# Altium project MDAP.PrjPcb
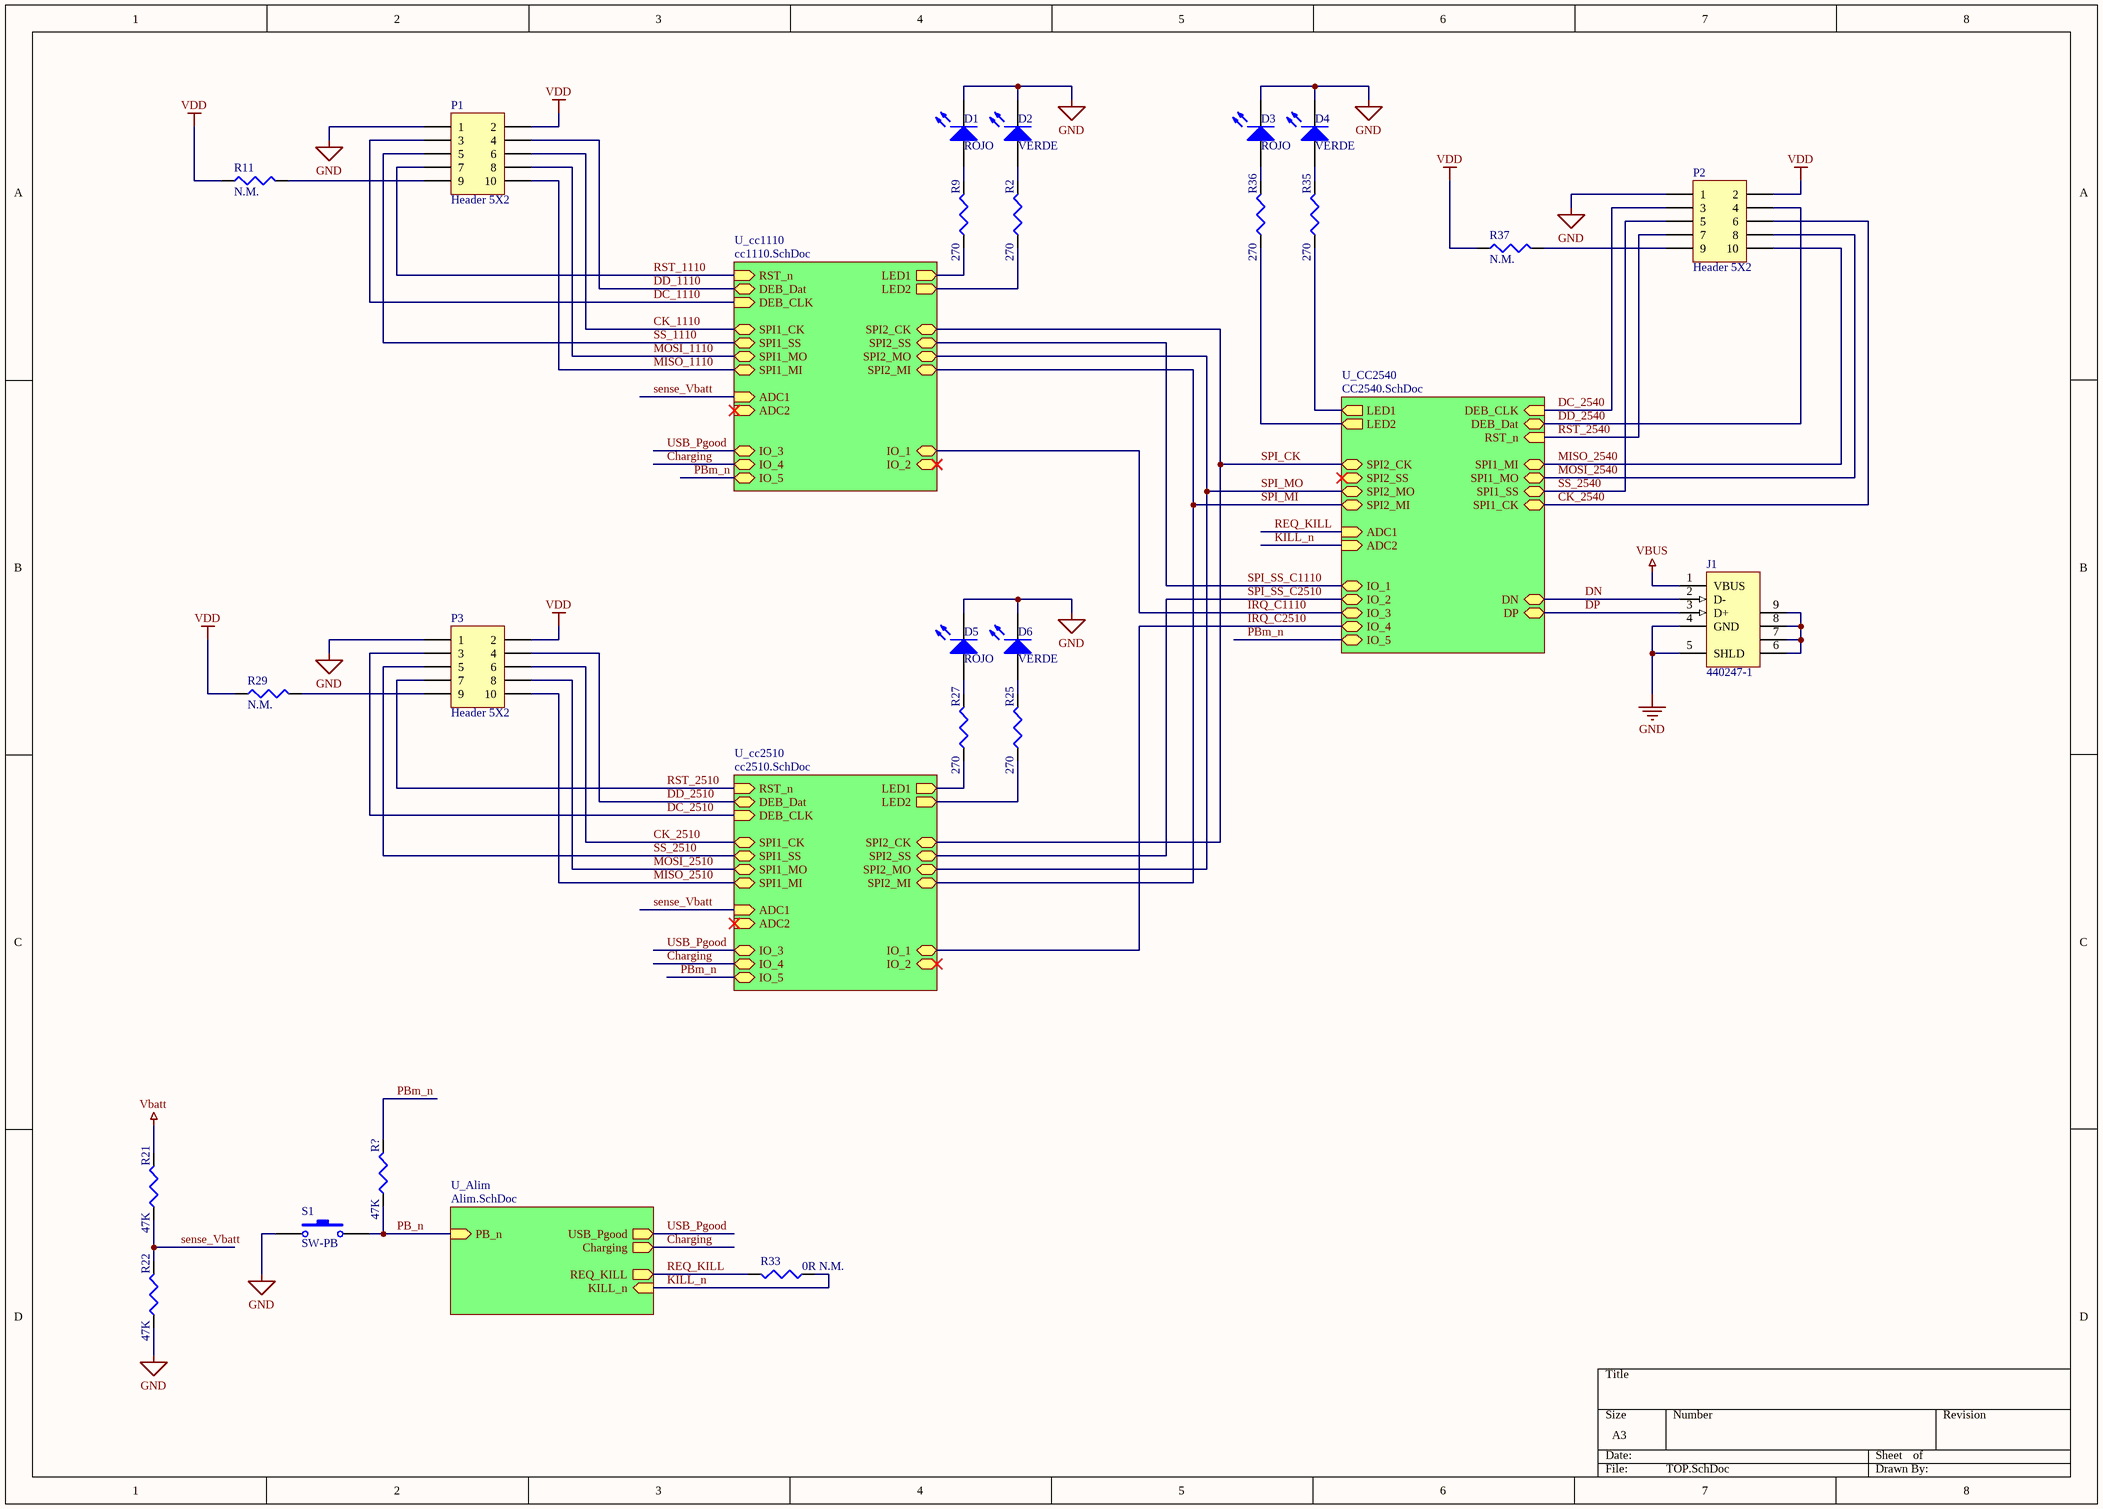
[diagram p0: TOP.SchDoc]
5 sheets, 153 parts. Net scope: hierarchical (ports join the sheet entries above them; power ports are global).
Board files: mdap.PcbDoc, mdap2.PcbDoc, mdap4.PcbDoc, mdap3.PcbDoc, mdap5.PcbDoc
Sheets:
  TOP.SchDoc
    U_cc1110 = cc1110.SchDoc
    U_cc2510 = cc2510.SchDoc
    U_CC2540 = CC2540.SchDoc
    U_Alim = Alim.SchDoc

## Sheet TOP.SchDoc
size A3

### Parts
D1  ROJO  [led_0805]
D2  VERDE  [led_0805]
D3  ROJO  [led_0805]
D4  VERDE  [led_0805]
D5  ROJO  [led_0805]
D6  VERDE  [led_0805]
J1  440247-1  [USB_C10418]
P1  Header 5X2  [stl21]
P2  Header 5X2  [stl21]
P3  Header 5X2  [stl21]
R2  value 270  [J1-0603]  (hidden comment: Res3)
R9  value 270  [J1-0603]  (hidden comment: Res3)
R11  value N.M.  [J1-0603]  (hidden comment: Res3)
R21  value 47K  [J1-0603]  (hidden comment: Res3)
R22  value 47K  [J1-0603]  (hidden comment: Res3)
R25  value 270  [J1-0603]  (hidden comment: Res3)
R27  value 270  [J1-0603]  (hidden comment: Res3)
R29  value N.M.  [J1-0603]  (hidden comment: Res3)
R33  value 0R N.M.  [J1-0603]  (hidden comment: Res3)
R35  value 270  [J1-0603]  (hidden comment: Res3)
R36  value 270  [J1-0603]  (hidden comment: Res3)
R37  value N.M.  [J1-0603]  (hidden comment: Res3)
R?  value 47K  [J1-0603]  (hidden comment: Res3)
S1  SW-PB  [puls_C3682]

### Sub-sheets
U_Alim = Alim.SchDoc: USB_Pgood (out), Charging (out), KILL_n (in), PB_n (in), REQ_KILL (out)
U_cc1110 = cc1110.SchDoc: DEB_Dat (bidir), DEB_CLK (in), RST_n (in), SPI1_MI (bidir), SPI1_MO (bidir), SPI1_SS (bidir), SPI1_CK (bidir), SPI2_CK (bidir), SPI2_SS (bidir), SPI2_MO (bidir), SPI2_MI (bidir), LED1 (out), LED2 (out), ADC1 (in), ADC2 (in), IO_1 (bidir), IO_2 (bidir), IO_3 (bidir), IO_4 (bidir), IO_5 (bidir)
U_cc2510 = cc2510.SchDoc: DEB_Dat (bidir), DEB_CLK (in), RST_n (in), SPI1_MI (bidir), SPI1_MO (bidir), SPI1_SS (bidir), SPI1_CK (bidir), SPI2_CK (bidir), SPI2_SS (bidir), SPI2_MO (bidir), SPI2_MI (bidir), LED1 (out), LED2 (out), ADC1 (in), ADC2 (in), IO_1 (bidir), IO_2 (bidir), IO_3 (bidir), IO_4 (bidir), IO_5 (bidir)
U_CC2540 = CC2540.SchDoc: DEB_Dat (bidir), DEB_CLK (in), RST_n (in), SPI1_MI (bidir), SPI1_MO (bidir), SPI1_SS (bidir), SPI1_CK (bidir), SPI2_CK (bidir), SPI2_SS (bidir), SPI2_MO (bidir), SPI2_MI (bidir), LED1 (out), LED2 (out), ADC1 (in), ADC2 (in), IO_1 (bidir), IO_2 (bidir), IO_3 (bidir), IO_4 (bidir), IO_5 (bidir), DP (bidir), DN (bidir)

### Nets
GND: D1.2(K) D2.2(K) D3.2(K) D4.2(K) D5.2(K) D6.2(K) J1.4(GND) J1.5(SHLD) P1.1 P2.1 P3.1 R22.1 S1.1
Vbatt: R21.2
VBUS: J1.1(VBUS)
VDD: P1.2 P2.2 P3.2 R11.1 R29.1 R37.1
Charging: sheet U_cc1110/IO_4, sheet U_cc2510/IO_4, sheet U_Alim/Charging
CK_1110: P1.6 ; sheet U_cc1110/SPI1_CK
CK_2510: P3.6 ; sheet U_cc2510/SPI1_CK
CK_2540: P2.6 ; sheet U_CC2540/SPI1_CK
DC_1110: P1.3 ; sheet U_cc1110/DEB_CLK
DC_2510: P3.3 ; sheet U_cc2510/DEB_CLK
DC_2540: P2.3 ; sheet U_CC2540/DEB_CLK
DD_1110: P1.4 ; sheet U_cc1110/DEB_Dat
DD_2510: P3.4 ; sheet U_cc2510/DEB_Dat
DD_2540: P2.4 ; sheet U_CC2540/DEB_Dat
DN: J1.2(D-) ; sheet U_CC2540/DN
DP: J1.3(D+) ; sheet U_CC2540/DP
IRQ_C1110: sheet U_cc1110/IO_1, sheet U_CC2540/IO_3
IRQ_C2510: sheet U_cc2510/IO_1, sheet U_CC2540/IO_4
KILL_n: R33.1 ; sheet U_CC2540/ADC2, sheet U_Alim/KILL_n
MISO_1110: P1.10 ; sheet U_cc1110/SPI1_MI
MISO_2510: P3.10 ; sheet U_cc2510/SPI1_MI
MISO_2540: P2.10 ; sheet U_CC2540/SPI1_MI
MOSI_1110: P1.8 ; sheet U_cc1110/SPI1_MO
MOSI_2510: P3.8 ; sheet U_cc2510/SPI1_MO
MOSI_2540: P2.8 ; sheet U_CC2540/SPI1_MO
PB_n: R?.1 S1.2 ; sheet U_Alim/PB_n
PBm_n: R?.2 ; sheet U_cc1110/IO_5, sheet U_cc2510/IO_5, sheet U_CC2540/IO_5
REQ_KILL: R33.2 ; sheet U_CC2540/ADC1, sheet U_Alim/REQ_KILL
RST_1110: P1.7 ; sheet U_cc1110/RST_n
RST_2510: P3.7 ; sheet U_cc2510/RST_n
RST_2540: P2.7 ; sheet U_CC2540/RST_n
sense_Vbatt: R21.1 R22.2 ; sheet U_cc1110/ADC1, sheet U_cc2510/ADC1
SPI_CK: sheet U_cc1110/SPI2_CK, sheet U_cc2510/SPI2_CK, sheet U_CC2540/SPI2_CK
SPI_MI: sheet U_cc1110/SPI2_MI, sheet U_cc2510/SPI2_MI, sheet U_CC2540/SPI2_MI
SPI_MO: sheet U_cc1110/SPI2_MO, sheet U_cc2510/SPI2_MO, sheet U_CC2540/SPI2_MO
SPI_SS_C1110: sheet U_cc1110/SPI2_SS, sheet U_CC2540/IO_1
SPI_SS_C2510: sheet U_cc2510/SPI2_SS, sheet U_CC2540/IO_2
SS_1110: P1.5 ; sheet U_cc1110/SPI1_SS
SS_2510: P3.5 ; sheet U_cc2510/SPI1_SS
SS_2540: P2.5 ; sheet U_CC2540/SPI1_SS
USB_Pgood: sheet U_cc1110/IO_3, sheet U_cc2510/IO_3, sheet U_Alim/USB_Pgood
NetD1_1: D1.1(A) R9.2
NetD2_1: D2.1(A) R2.2
NetD3_1: D3.1(A) R36.2
NetD4_1: D4.1(A) R35.2
NetD5_1: D5.1(A) R27.2
NetD6_1: D6.1(A) R25.2
NetJ1_6: J1.6(SHLD) J1.7(SHLD) J1.8(SHLD) J1.9(SHLD)
NetP1_9: P1.9 R11.2
NetP2_9: P2.9 R37.2
NetP3_9: P3.9 R29.2
NetR2_1: R2.1 ; sheet U_cc1110/LED2
NetR9_1: R9.1 ; sheet U_cc1110/LED1
NetR25_1: R25.1 ; sheet U_cc2510/LED2
NetR27_1: R27.1 ; sheet U_cc2510/LED1
NetR35_1: R35.1 ; sheet U_CC2540/LED1
NetR36_1: R36.1 ; sheet U_CC2540/LED2

### Library data of the parts
D1 D3 D5 = LED2: Typical RED, GREEN, YELLOW, AMBER GaAs LED; Manufacturer: Smart Prototyping; SP: SP-C2286; FARNELL: 2099236; Value: Rojo; Order N: SP-C2286
D2 D4 D6 = LED2: Typical RED, GREEN, YELLOW, AMBER GaAs LED; Manufacturer: Smart Prototyping; SP: SP-C2292; FARNELL: 2290331; Value: Verde; Order N: SP-C2292
J1 = 440247-1: USB 2.0, Right Angle, SMT, B Type, Receptacle, 5 Position, Black; Manufacturer: Smart Prototyping; SP: SP-C10418; Published: 15-Jul-2004; PackageReference: 440247; Publisher: Altium Limited; Order N: SP-C10418
P1-P3 = Header 5X2: Header, 5-Pin, Dual row; Manufacturer: Smart Prototyping; SP: SP-C12650; LatestRevisionDate: 17-Jul-2002; LatestRevisionNote: Re-released for DXP Platform.; Publisher: Altium Limited; Order N: SP-C12650
R2 R9 R25 R27 R35 R36 = Res3: Resistor; Manufacturer: FARNELL; RS: 721-7292; Order N: 2331719; Published: 8-Jun-2000; LatestRevisionDate: 29-May-2009; LatestRevisionNote: IPC-7351 Footprint Added.; PackageReference: J1-0603; Publisher: Altium Limited; PackageDescription: Chip Resistor; FARNELL: 2331719
R11 R29 R37 = Res3: Resistor; Published: 8-Jun-2000; LatestRevisionDate: 29-May-2009; LatestRevisionNote: IPC-7351 Footprint Added.; PackageReference: J1-0603; Publisher: Altium Limited; PackageDescription: Chip Resistor
R21 R22 R? = Res3: Resistor; Manufacturer: FARNELL; RS: N.E.; Order N: 2331749; Published: 8-Jun-2000; LatestRevisionDate: 29-May-2009; LatestRevisionNote: IPC-7351 Footprint Added.; PackageReference: J1-0603; Publisher: Altium Limited; PackageDescription: Chip Resistor; FARNELL: 2331749
R33 = Res3: Resistor; RS: 740-8870; Published: 8-Jun-2000; LatestRevisionDate: 29-May-2009; LatestRevisionNote: IPC-7351 Footprint Added.; PackageReference: J1-0603; Publisher: Altium Limited; PackageDescription: Chip Resistor; FARNELL: 2309106
S1 = SW-PB: Switch; Manufacturer: Smart Prototyping; SP: SP-C3682; Published: 24-Mar-1999; LatestRevisionDate: 17-Jul-2002; LatestRevisionNote: Re-released for DXP Platform.; PackageReference: SPST-2; Publisher: Altium Limited; PackageDescription: Switch; 2 Leads; Order N: SP-C3682

## Sheet cc1110.SchDoc
size A3
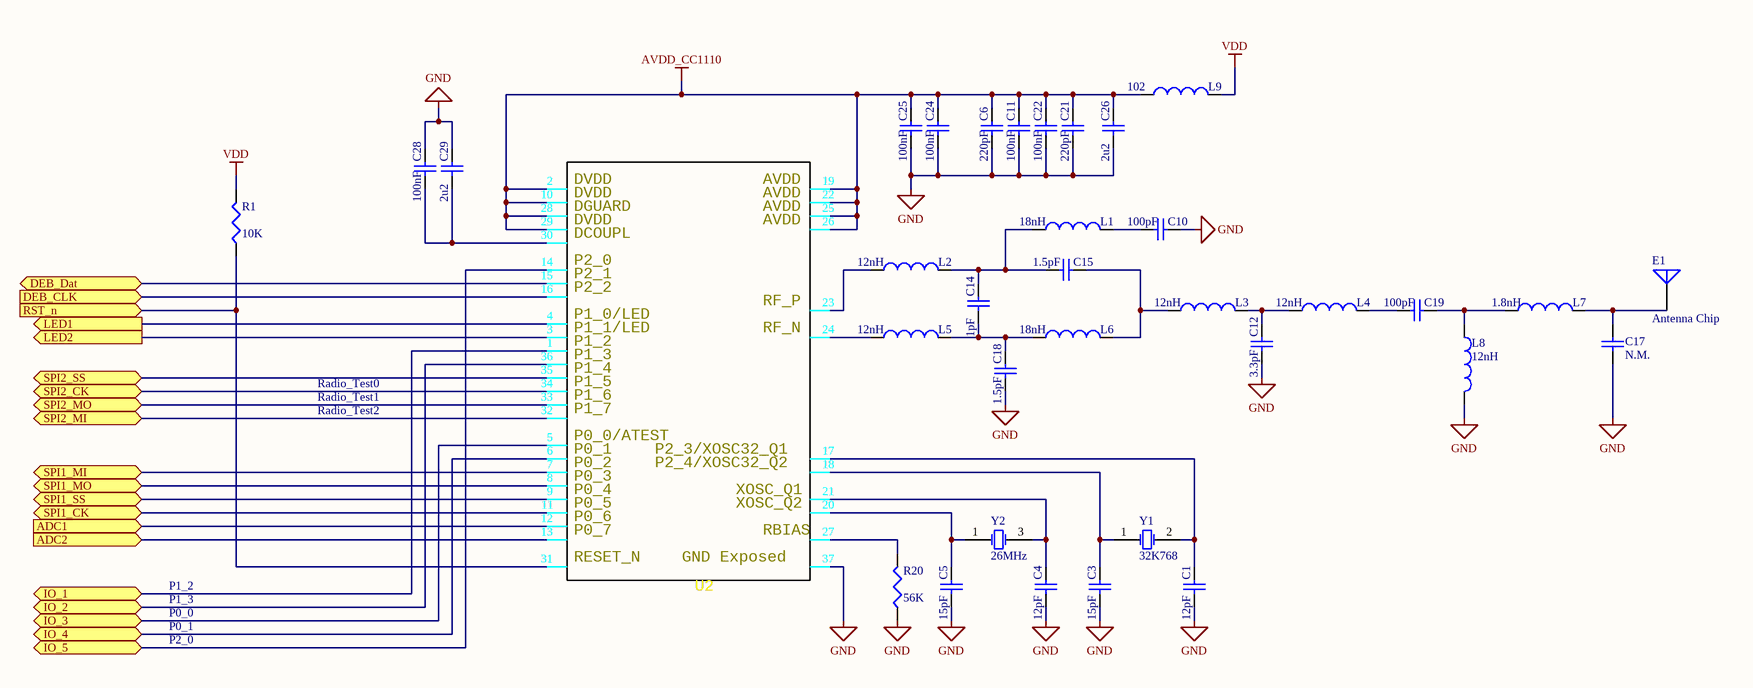
[diagram p1: cc1110.SchDoc]

### Parts
C1  value 12pF  [0402]  (hidden comment: Cap)
C3  value 15pF  [0402]  (hidden comment: Cap)
C4  value 12pF  [0402]  (hidden comment: Cap)
C5  value 15pF  [0402]  (hidden comment: Cap)
C6  value 220pF  [0402]  (hidden comment: Cap)
C10  value 100pF  [0402]  (hidden comment: Cap)
C11  value 100nF  [0402]  (hidden comment: Cap)
C12  value 3.3pF  [0402]  (hidden comment: Cap)
C14  value 1pF  [0402]  (hidden comment: Cap)
C15  value 1.5pF  [0402]  (hidden comment: Cap)
C17  value N.M.  [0402]  (hidden comment: Cap)
C18  value 1.5pF  [0402]  (hidden comment: Cap)
C19  value 100pF  [0402]  (hidden comment: Cap)
C21  value 220pF  [0402]  (hidden comment: Cap)
C22  value 100nF  [0402]  (hidden comment: Cap)
C24  value 100nF  [0402]  (hidden comment: Cap)
C25  value 100nF  [0402]  (hidden comment: Cap)
C26  value 2u2  [C0805]  (hidden comment: Cap)
C28  value 100nF  [0402]  (hidden comment: Cap)
C29  value 2u2  [C0805]  (hidden comment: Cap)
E1  Antenna Chip  [Johanson_0868AT43A0020]
L1  value 18nH  [0402-A]  (hidden comment: Inductor)
L2  value 12nH  [0402-A]  (hidden comment: Inductor)
L3  value 12nH  [0402-A]  (hidden comment: Inductor)
L4  value 12nH  [0402-A]  (hidden comment: Inductor)
L5  value 12nH  [0402-A]  (hidden comment: Inductor)
L6  value 18nH  [0402-A]  (hidden comment: Inductor)
L7  value 1.8nH  [0402-A]  (hidden comment: Inductor)
L8  value 12nH  [0402-A]  (hidden comment: Inductor)
L9  value 102  [0402-A]  (hidden comment: Inductor)
R1  value 10K  [J1-0603]  (hidden comment: Res3)
R20  value 56K  [J1-0603]  (hidden comment: Res3)
U2  CC1110  [QLP36_4_4 (Reflow)]  (value not drawn)
Y1  32K768  [xtal_3215]
Y2  26MHz  [xtal_3225]

### Ports
ADC1 (in), ADC2 (in), DEB_CLK (in), DEB_Dat (bidir), IO_1 (bidir), IO_2 (bidir), IO_3 (bidir), IO_4 (bidir), IO_5 (bidir), LED1 (out), LED2 (out), RST_n (in), SPI1_CK (bidir), SPI1_MI (bidir), SPI1_MO (bidir), SPI1_SS (bidir), SPI2_CK (bidir), SPI2_MI (bidir), SPI2_MO (bidir), SPI2_SS (bidir)

### Nets
AVDD_CC1110: C6.2 C11.2 C21.2 C22.2 C24.2 C25.2 C26.2 L9.1 U2.2 U2.10 U2.19 U2.22 U2.25 U2.26 U2.28 U2.29
GND: C1.1 C3.1 C4.1 C5.1 C6.1 C10.1 C11.1 C12.1 C17.2 C18.1 C21.1 C22.1 C24.1 C25.1 C26.1 C28.2 C29.2 L8.2 R20.1 U2.37
VDD: L9.2 R1.2
Charging: U2.6 ; port IO_4
CK_1110: U2.11 ; port SPI1_CK
DC_1110: U2.16 ; port DEB_CLK
DD_1110: U2.15 ; port DEB_Dat
IRQ_C1110: U2.1 ; port IO_1
MISO_1110: U2.7 ; port SPI1_MI
MOSI_1110: U2.8 ; port SPI1_MO
PBm_n: U2.14 ; port IO_5
RST_1110: R1.1 U2.31 ; port RST_n
sense_Vbatt: U2.12 ; port ADC1
SPI_CK: U2.34 ; port SPI2_CK
SPI_MI: U2.32 ; port SPI2_MI
SPI_MO: U2.33 ; port SPI2_MO
SPI_SS_C1110: U2.35 ; port SPI2_SS
SS_1110: U2.9 ; port SPI1_SS
USB_Pgood: U2.5 ; port IO_3
NetC1_2: C1.2 U2.17 Y1.2(OSC2)
NetC3_2: C3.2 U2.18 Y1.1(OSC1)
NetC4_2: C4.2 U2.21 Y2.3(OSC2)
NetC5_2: C5.2 U2.20 Y2.1(OSC1)
NetC10_2: C10.2 L1.2
NetC12_2: C12.2 L3.2 L4.1
NetC14_1: C14.1 C18.2 L5.2 L6.1
NetC14_2: C14.2 C15.2 L1.1 L2.2
NetC15_1: C15.1 L3.1 L6.2
NetC17_1: C17.1 E1.1(A) L7.2
NetC19_1: C19.1 L7.1 L8.1
NetC19_2: C19.2 L4.2
NetC28_1: C28.1 C29.1 U2.30
NetL2_1: L2.1 U2.23
NetL5_1: L5.1 U2.24
NetR2_1: U2.3 ; port LED2
NetR9_1: U2.4 ; port LED1
NetR20_2: R20.2 U2.27
NetU2_13: U2.13 ; port ADC2
NetU2_36: U2.36 ; port IO_2

### Notes on the sheet
- Radio_Test0
- Radio_Test1
- Radio_Test2
- P1_2
- P1_3
- P0_0
- P0_1
- P2_0
- (in symbol CC1110) DVDD; AVDD; DGUARD; DCOUPL; P2_0; P2_1; P2_2; RF_P; P1_0/LED; P1_1/LED; RF_N; P1_2; P1_3; P1_4; P1_5; P1_6; P1_7; P0_0/ATEST; P0_1; P2_3/XOSC32_Q1; P0_2; P2_4/XOSC32_Q2; P0_3; P0_4; XOSC_Q1; P0_5; XOSC_Q2; P0_6; P0_7; RBIAS; RESET_N; GND Exposed

### Library data of the parts
C1 C4 = Cap: Capacitor; Manufacturer: FARNELL; RS: 788-0263; Order N: 2210762; Published: 8-Jun-2000; LatestRevisionDate: 17-Jul-2002; LatestRevisionNote: Re-released for DXP Platform.; PackageReference: RAD-0.3; Publisher: Altium Limited; PackageDescription: Radial Cap, Thru-Hole; 2 Leads; 0.3 in Pin Spacing; FARNELL: 2210762
C3 C5 = Cap: Capacitor; Manufacturer: FARNELL; RS: 788-0266; Order N: 2218840; Published: 8-Jun-2000; LatestRevisionDate: 17-Jul-2002; LatestRevisionNote: Re-released for DXP Platform.; PackageReference: RAD-0.3; Publisher: Altium Limited; PackageDescription: Radial Cap, Thru-Hole; 2 Leads; 0.3 in Pin Spacing; FARNELL: 2218840
C6 C21 = Cap: Capacitor; Manufacturer: FARNELL; RS: 624-2941; Order N: 2426879; Published: 8-Jun-2000; LatestRevisionDate: 17-Jul-2002; LatestRevisionNote: Re-released for DXP Platform.; PackageReference: RAD-0.3; Publisher: Altium Limited; PackageDescription: Radial Cap, Thru-Hole; 2 Leads; 0.3 in Pin Spacing; FARNELL: 2426879
C10 C19 = Cap: Capacitor; Manufacturer: FARNELL; RS: 806-8495; Order N: 2426878; Published: 8-Jun-2000; LatestRevisionDate: 17-Jul-2002; LatestRevisionNote: Re-released for DXP Platform.; PackageReference: RAD-0.3; Publisher: Altium Limited; PackageDescription: Radial Cap, Thru-Hole; 2 Leads; 0.3 in Pin Spacing; FARNELL: 2426878
C11 C22 C24 C25 C28 = Cap: Capacitor; Manufacturer: FARNELL; RS: 788-2843; Order N: 2309011; Published: 8-Jun-2000; LatestRevisionDate: 17-Jul-2002; LatestRevisionNote: Re-released for DXP Platform.; PackageReference: RAD-0.3; Publisher: Altium Limited; PackageDescription: Radial Cap, Thru-Hole; 2 Leads; 0.3 in Pin Spacing; FARNELL: 2309011
C12 = Cap: Capacitor; Manufacturer: FARNELL; RS: 751-2049; Order N: 2210780; Published: 8-Jun-2000; LatestRevisionDate: 17-Jul-2002; LatestRevisionNote: Re-released for DXP Platform.; PackageReference: RAD-0.3; Publisher: Altium Limited; PackageDescription: Radial Cap, Thru-Hole; 2 Leads; 0.3 in Pin Spacing; FARNELL: 2210780
C14 = Cap: Capacitor; Manufacturer: FARNELL; RS: 788-0279; Order N: 1611944; Published: 8-Jun-2000; LatestRevisionDate: 17-Jul-2002; LatestRevisionNote: Re-released for DXP Platform.; PackageReference: RAD-0.3; Publisher: Altium Limited; PackageDescription: Radial Cap, Thru-Hole; 2 Leads; 0.3 in Pin Spacing; FARNELL: 1611944
C15 C18 = Cap: Capacitor; Manufacturer: FARNELL; RS: 788-0276; Order N: 1828869; Published: 8-Jun-2000; LatestRevisionDate: 17-Jul-2002; LatestRevisionNote: Re-released for DXP Platform.; PackageReference: RAD-0.3; Publisher: Altium Limited; PackageDescription: Radial Cap, Thru-Hole; 2 Leads; 0.3 in Pin Spacing; FARNELL: 1828869
C17 = Cap: Capacitor; Published: 8-Jun-2000; LatestRevisionDate: 17-Jul-2002; LatestRevisionNote: Re-released for DXP Platform.; PackageReference: RAD-0.3; Publisher: Altium Limited; PackageDescription: Radial Cap, Thru-Hole; 2 Leads; 0.3 in Pin Spacing
C26 C29 = Cap: Capacitor; Manufacturer: FARNELL; RS: 749-2138; Order N: 1759416; Published: 8-Jun-2000; LatestRevisionDate: 17-Jul-2002; LatestRevisionNote: Re-released for DXP Platform.; PackageReference: RAD-0.3; Publisher: Altium Limited; PackageDescription: Radial Cap, Thru-Hole; 2 Leads; 0.3 in Pin Spacing; FARNELL: 1759416
E1 = Antenna: Generic Antenna; Manufacturer: FARNELL; RS: N.E.; PN: 0868AT43A0020E; Order N: 1885493; Published: 24-Mar-1999; LatestRevisionDate: 17-Jul-2002; LatestRevisionNote: Re-released for DXP Platform.; PackageReference: PIN1; Publisher: Altium Limited; FARNELL: 1885493
L1 L6 = Inductor: Manufacturer: FARNELL; Code_IEC: 1005; RS: 777-7022; Order N: 2103101; Published: 8-Jun-2000; LatestRevisionDate: 29-May-2009; LatestRevisionNote: IPC-7351 Footprint Added.; PackageReference: 0402-A; Publisher: Altium Limited; PackageDescription: Chip Inductor; Code_JEITA: 0402; FARNELL: 2103101
L2-L5 L8 = Inductor: Manufacturer: FARNELL; Code_IEC: 1005; RS: 701-6910; Order N: 2103098; Published: 8-Jun-2000; LatestRevisionDate: 29-May-2009; LatestRevisionNote: IPC-7351 Footprint Added.; PackageReference: 0402-A; Publisher: Altium Limited; PackageDescription: Chip Inductor; Code_JEITA: 0402; FARNELL: 2103098
L7 = Inductor: Manufacturer: FARNELL; Code_IEC: 1005; RS: 701-6807; Order N: 1669627; Published: 8-Jun-2000; LatestRevisionDate: 29-May-2009; LatestRevisionNote: IPC-7351 Footprint Added.; PackageReference: 0402-A; Publisher: Altium Limited; PackageDescription: Chip Inductor; Code_JEITA: 0402; FARNELL: 1669627
L9 = Inductor: Manufacturer: FARNELL; Code_IEC: 1005; RS: 777-6861; Order N: 1669624; Published: 8-Jun-2000; LatestRevisionDate: 29-May-2009; LatestRevisionNote: IPC-7351 Footprint Added.; PackageReference: 0402-A; Publisher: Altium Limited; PackageDescription: Chip Inductor; Code_JEITA: 0402; FARNELL: 1669624
R1 = Res3: Resistor; Manufacturer: FARNELL; RS: N.E.; Order N: 2333520; Published: 8-Jun-2000; LatestRevisionDate: 29-May-2009; LatestRevisionNote: IPC-7351 Footprint Added.; PackageReference: J1-0603; Publisher: Altium Limited; PackageDescription: Chip Resistor; FARNELL: 2333520
R20 = Res3: Resistor; Manufacturer: FARNELL; RS: N.E.; Order N: 2331750; Published: 8-Jun-2000; LatestRevisionDate: 29-May-2009; LatestRevisionNote: IPC-7351 Footprint Added.; PackageReference: J1-0603; Publisher: Altium Limited; PackageDescription: Chip Resistor; FARNELL: 2331750
U2 = CC1110: Single chip transceiver; Manufacturer: FARNELL; RS: 459-342; PN: CC1110F32RHHR; Order N: 2422916; FARNELL: 2422916
Y1 = XTAL: Crystal Oscillator; Manufacturer: Smart Prototyping; SP: SP-C14473; Value: 32.768KHz; FARNELL: 2449398; Order N: SP-C14473
Y2 = XTAL_4: Crystal Oscillator; Manufacturer: Smart Prototyping; SP: SP-C23363; RS: *; FARNELL: 2101340; Value: 26MHz; Order N: SP-C23363

## Sheet cc2510.SchDoc
size A3
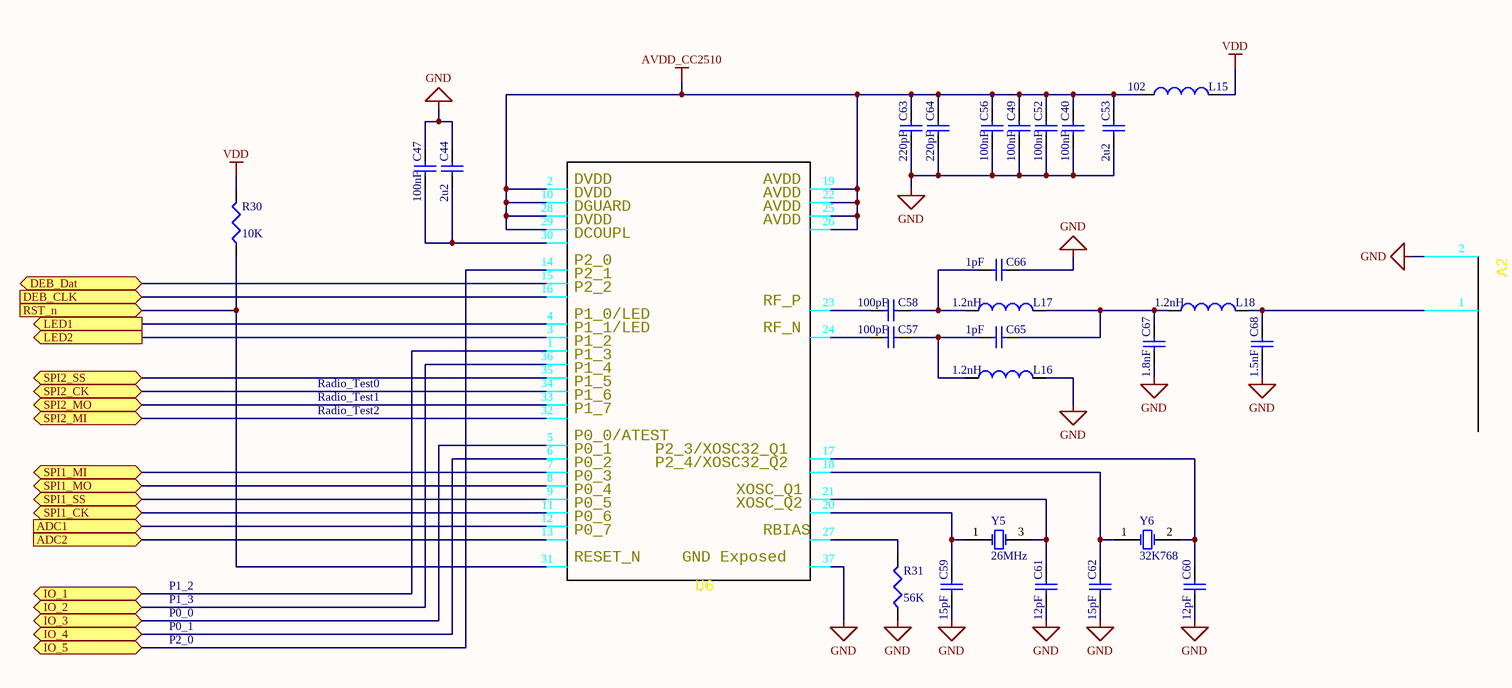
[diagram p2: cc2510.SchDoc]

### Parts
A2  Antenna_IIFA_1  [antenna_IIFA_1]  (value not drawn)
C40  value 100nF  [0402]  (hidden comment: Cap)
C44  value 2u2  [C0805]  (hidden comment: Cap)
C47  value 100nF  [0402]  (hidden comment: Cap)
C49  value 100nF  [0402]  (hidden comment: Cap)
C52  value 100nF  [0402]  (hidden comment: Cap)
C53  value 2u2  [C0805]  (hidden comment: Cap)
C56  value 100nF  [0402]  (hidden comment: Cap)
C57  value 100pF  [0402]  (hidden comment: Cap)
C58  value 100pF  [0402]  (hidden comment: Cap)
C59  value 15pF  [0402]  (hidden comment: Cap)
C60  value 12pF  [0402]  (hidden comment: Cap)
C61  value 12pF  [0402]  (hidden comment: Cap)
C62  value 15pF  [0402]  (hidden comment: Cap)
C63  value 220pF  [0402]  (hidden comment: Cap)
C64  value 220pF  [0402]  (hidden comment: Cap)
C65  value 1pF  [0402]  (hidden comment: Cap)
C66  value 1pF  [0402]  (hidden comment: Cap)
C67  value 1.8nF  [0402]  (hidden comment: Cap)
C68  value 1.5nF  [0402]  (hidden comment: Cap)
L15  value 102  [0402-A]  (hidden comment: Inductor)
L16  value 1.2nH  [0402-A]  (hidden comment: Inductor)
L17  value 1.2nH  [0402-A]  (hidden comment: Inductor)
L18  value 1.2nH  [0402-A]  (hidden comment: Inductor)
R30  value 10K  [J1-0603]  (hidden comment: Res3)
R31  value 56K  [J1-0603]  (hidden comment: Res3)
U6  CC2510  [QLP36_4_4 norteam silk (Reflow)]  (value not drawn)
Y5  26MHz  [xtal_3225]
Y6  32K768  [xtal_3215]

### Ports
ADC1 (in), ADC2 (in), DEB_CLK (in), DEB_Dat (bidir), IO_1 (bidir), IO_2 (bidir), IO_3 (bidir), IO_4 (bidir), IO_5 (bidir), LED1 (out), LED2 (out), RST_n (in), SPI1_CK (bidir), SPI1_MI (bidir), SPI1_MO (bidir), SPI1_SS (bidir), SPI2_CK (bidir), SPI2_MI (bidir), SPI2_MO (bidir), SPI2_SS (bidir)

### Nets
AVDD_CC2510: C40.2 C49.2 C52.2 C53.2 C56.2 C63.2 C64.2 L15.1 U6.2 U6.10 U6.19 U6.22 U6.25 U6.26 U6.28 U6.29
GND: A2.2 C40.1 C44.2 C47.2 C49.1 C52.1 C53.1 C56.1 C59.1 C60.1 C61.1 C62.1 C63.1 C64.1 C66.1 C67.1 C68.1 L16.2 R31.1 U6.37
VDD: L15.2 R30.2
Charging: U6.6 ; port IO_4
CK_2510: U6.11 ; port SPI1_CK
DC_2510: U6.16 ; port DEB_CLK
DD_2510: U6.15 ; port DEB_Dat
IRQ_C2510: U6.1 ; port IO_1
MISO_2510: U6.7 ; port SPI1_MI
MOSI_2510: U6.8 ; port SPI1_MO
PBm_n: U6.14 ; port IO_5
RST_2510: R30.1 U6.31 ; port RST_n
sense_Vbatt: U6.12 ; port ADC1
SPI_CK: U6.34 ; port SPI2_CK
SPI_MI: U6.32 ; port SPI2_MI
SPI_MO: U6.33 ; port SPI2_MO
SPI_SS_C2510: U6.35 ; port SPI2_SS
SS_2510: U6.9 ; port SPI1_SS
USB_Pgood: U6.5 ; port IO_3
NetA2_1: A2.1 C68.2 L18.2
NetC44_1: C44.1 C47.1 U6.30
NetC57_1: C57.1 C65.2 L16.1
NetC57_2: C57.2 U6.24
NetC58_1: C58.1 C66.2 L17.1
NetC58_2: C58.2 U6.23
NetC59_2: C59.2 U6.20 Y5.1(OSC1)
NetC60_2: C60.2 U6.17 Y6.2(OSC2)
NetC61_2: C61.2 U6.21 Y5.3(OSC2)
NetC62_2: C62.2 U6.18 Y6.1(OSC1)
NetC65_1: C65.1 C67.2 L17.2 L18.1
NetR25_1: U6.3 ; port LED2
NetR27_1: U6.4 ; port LED1
NetR31_2: R31.2 U6.27
NetU6_13: U6.13 ; port ADC2
NetU6_36: U6.36 ; port IO_2

### Notes on the sheet
- Radio_Test0
- Radio_Test1
- Radio_Test2
- P1_2
- P1_3
- P0_0
- P0_1
- P2_0
- (in symbol CC2510) DVDD; AVDD; DGUARD; DCOUPL; P2_0; P2_1; P2_2; RF_P; P1_0/LED; P1_1/LED; RF_N; P1_2; P1_3; P1_4; P1_5; P1_6; P1_7; P0_0/ATEST; P0_1; P2_3/XOSC32_Q1; P0_2; P2_4/XOSC32_Q2; P0_3; P0_4; XOSC_Q1; P0_5; XOSC_Q2; P0_6; P0_7; RBIAS; RESET_N; GND Exposed

### Library data of the parts
A2 = Antenna_IIFA_1: Antenna single ended IIFA, 2450 MHz
C40 C47 C49 C52 C56 = Cap: as C11 on sheet cc1110; Published: 8-Jun-2000; LatestRevisionDate: 17-Jul-2002; LatestRevisionNote: Re-released for DXP Platform.; PackageReference: RAD-0.3; Publisher: Altium Limited; PackageDescription: Radial Cap, Thru-Hole; 2 Leads; 0.3 in Pin Spacing; FARNELL: 2309011
C44 C53 = Cap: as C26 on sheet cc1110; Published: 8-Jun-2000; LatestRevisionDate: 17-Jul-2002; LatestRevisionNote: Re-released for DXP Platform.; PackageReference: RAD-0.3; Publisher: Altium Limited; PackageDescription: Radial Cap, Thru-Hole; 2 Leads; 0.3 in Pin Spacing; FARNELL: 1759416
C57 C58 = Cap: as C10 on sheet cc1110; Published: 8-Jun-2000; LatestRevisionDate: 17-Jul-2002; LatestRevisionNote: Re-released for DXP Platform.; PackageReference: RAD-0.3; Publisher: Altium Limited; PackageDescription: Radial Cap, Thru-Hole; 2 Leads; 0.3 in Pin Spacing; FARNELL: 2426878
C59 C62 = Cap: as C3 on sheet cc1110; Published: 8-Jun-2000; LatestRevisionDate: 17-Jul-2002; LatestRevisionNote: Re-released for DXP Platform.; PackageReference: RAD-0.3; Publisher: Altium Limited; PackageDescription: Radial Cap, Thru-Hole; 2 Leads; 0.3 in Pin Spacing; FARNELL: 2218840
C60 C61 = Cap: as C1 on sheet cc1110; Published: 8-Jun-2000; LatestRevisionDate: 17-Jul-2002; LatestRevisionNote: Re-released for DXP Platform.; PackageReference: RAD-0.3; Publisher: Altium Limited; PackageDescription: Radial Cap, Thru-Hole; 2 Leads; 0.3 in Pin Spacing; FARNELL: 2210762
C63 C64 = Cap: as C6 on sheet cc1110; Published: 8-Jun-2000; LatestRevisionDate: 17-Jul-2002; LatestRevisionNote: Re-released for DXP Platform.; PackageReference: RAD-0.3; Publisher: Altium Limited; PackageDescription: Radial Cap, Thru-Hole; 2 Leads; 0.3 in Pin Spacing; FARNELL: 2426879
C65 C66 = Cap: as C14 on sheet cc1110; Published: 8-Jun-2000; LatestRevisionDate: 17-Jul-2002; LatestRevisionNote: Re-released for DXP Platform.; PackageReference: RAD-0.3; Publisher: Altium Limited; PackageDescription: Radial Cap, Thru-Hole; 2 Leads; 0.3 in Pin Spacing; FARNELL: 1611944
C67 = Cap: Capacitor; Manufacturer: FARNELL; RS: 755-2033; Order N: 1865457; Published: 8-Jun-2000; LatestRevisionDate: 17-Jul-2002; LatestRevisionNote: Re-released for DXP Platform.; PackageReference: RAD-0.3; Publisher: Altium Limited; PackageDescription: Radial Cap, Thru-Hole; 2 Leads; 0.3 in Pin Spacing; FARNELL: 1865457
C68 = Cap: Capacitor; Manufacturer: FARNELL; RS: 806-8489; Order N: 2210797; Published: 8-Jun-2000; LatestRevisionDate: 17-Jul-2002; LatestRevisionNote: Re-released for DXP Platform.; PackageReference: RAD-0.3; Publisher: Altium Limited; PackageDescription: Radial Cap, Thru-Hole; 2 Leads; 0.3 in Pin Spacing; FARNELL: 2210797
L15 = Inductor: as L9 on sheet cc1110; Published: 8-Jun-2000; LatestRevisionDate: 29-May-2009; LatestRevisionNote: IPC-7351 Footprint Added.; PackageReference: 0402-A; Publisher: Altium Limited; PackageDescription: Chip Inductor; Code_JEITA: 0402; FARNELL: 1669624
L16-L18 = Inductor: Manufacturer: FARNELL; Code_IEC: 1005; RS: 701-6784; Order N: 1704133; Published: 8-Jun-2000; LatestRevisionDate: 29-May-2009; LatestRevisionNote: IPC-7351 Footprint Added.; PackageReference: 0402-A; Publisher: Altium Limited; PackageDescription: Chip Inductor; Code_JEITA: 0402; FARNELL: 1704133
R30 = Res3: as R1 on sheet cc1110; Published: 8-Jun-2000; LatestRevisionDate: 29-May-2009; LatestRevisionNote: IPC-7351 Footprint Added.; PackageReference: J1-0603; Publisher: Altium Limited; PackageDescription: Chip Resistor; FARNELL: 2333520
R31 = Res3: as R20 on sheet cc1110; Published: 8-Jun-2000; LatestRevisionDate: 29-May-2009; LatestRevisionNote: IPC-7351 Footprint Added.; PackageReference: J1-0603; Publisher: Altium Limited; PackageDescription: Chip Resistor; FARNELL: 2331750
U6 = CC2510: Single chip transceiver; Manufacturer: FARNELL; RS: 459-540; PN: CC2510F16RSP; Order N: 1549254; FARNELL: 1549254
Y5 = XTAL_4: as Y2 on sheet cc1110; RS: *; FARNELL: 2101340; Value: 26MHz; Order N: SP-C23363
Y6 = XTAL: as Y1 on sheet cc1110; FARNELL: 2449398; Order N: SP-C14473

## Sheet CC2540.SchDoc
size A4
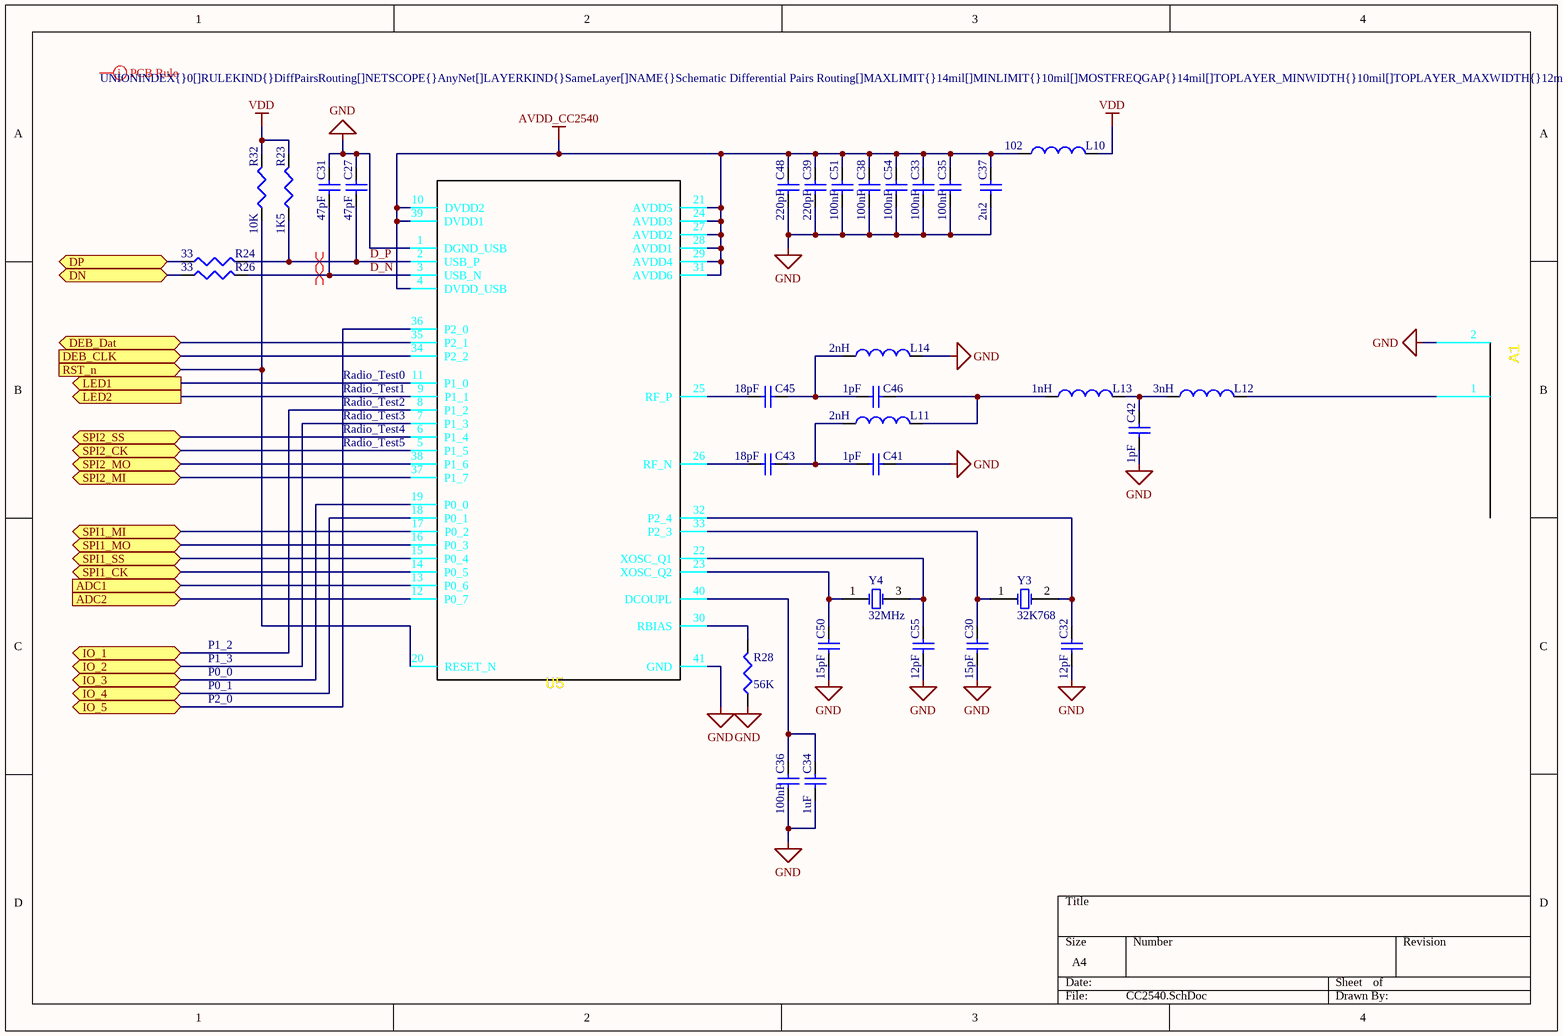
[diagram p3: CC2540.SchDoc]

### Parts
A1  Antenna_IIFA_1  [antenna_IIFA_1]  (value not drawn)
C27  value 47pF  [0402]  (hidden comment: Cap)
C30  value 15pF  [0402]  (hidden comment: Cap)
C31  value 47pF  [0402]  (hidden comment: Cap)
C32  value 12pF  [0402]  (hidden comment: Cap)
C33  value 100nF  [0402]  (hidden comment: Cap)
C34  value 1uF  [C0805]  (hidden comment: Cap)
C35  value 100nF  [0402]  (hidden comment: Cap)
C36  value 100nF  [0402]  (hidden comment: Cap)
C37  value 2u2  [C0805]  (hidden comment: Cap)
C38  value 100nF  [0402]  (hidden comment: Cap)
C39  value 220pF  [0402]  (hidden comment: Cap)
C41  value 1pF  [0402]  (hidden comment: Cap)
C42  value 1pF  [0402]  (hidden comment: Cap)
C43  value 18pF  [0402]  (hidden comment: Cap)
C45  value 18pF  [0402]  (hidden comment: Cap)
C46  value 1pF  [0402]  (hidden comment: Cap)
C48  value 220pF  [0402]  (hidden comment: Cap)
C50  value 15pF  [0402]  (hidden comment: Cap)
C51  value 100nF  [0402]  (hidden comment: Cap)
C54  value 100nF  [0402]  (hidden comment: Cap)
C55  value 12pF  [0402]  (hidden comment: Cap)
L10  value 102  [0402-A]  (hidden comment: Inductor)
L11  value 2nH  [0402-A]  (hidden comment: Inductor)
L12  value 3nH  [0402-A]  (hidden comment: Inductor)
L13  value 1nH  [0402-A]  (hidden comment: Inductor)
L14  value 2nH  [0402-A]  (hidden comment: Inductor)
R23  value 1K5  [J1-0603]  (hidden comment: Res3)
R24  value 33  [J1-0603]  (hidden comment: Res3)
R26  value 33  [J1-0603]  (hidden comment: Res3)
R28  value 56K  [J1-0603]  (hidden comment: Res3)
R32  value 10K  [J1-0603]  (hidden comment: Res3)
U5  CC2540  [QFN40_RHA (DATASHEET)]  (value not drawn)
Y3  32K768  [xtal_3215]
Y4  32MHz  [xtal_3225]

### Ports
ADC1 (in), ADC2 (in), DEB_CLK (in), DEB_Dat (bidir), DN (bidir), DP (bidir), IO_1 (bidir), IO_2 (bidir), IO_3 (bidir), IO_4 (bidir), IO_5 (bidir), LED1 (out), LED2 (out), RST_n (in), SPI1_CK (bidir), SPI1_MI (bidir), SPI1_MO (bidir), SPI1_SS (bidir), SPI2_CK (bidir), SPI2_MI (bidir), SPI2_MO (bidir), SPI2_SS (bidir)

### Nets
AVDD_CC2540: C33.2 C35.2 C37.2 C38.2 C39.2 C48.2 C51.2 C54.2 L10.1 U5.4(DVDD_USB) U5.10(DVDD2) U5.21(AVDD5) U5.24(AVDD3) U5.27(AVDD2) U5.28(AVDD1) U5.29(AVDD4) U5.31(AVDD6) U5.39(DVDD1)
GND: A1.2 C27.2 C30.1 C31.2 C32.1 C33.1 C34.1 C35.1 C36.1 C37.1 C38.1 C39.1 C41.1 C42.1 C48.1 C50.1 C51.1 C54.1 C55.1 L14.2 R28.1 U5.1(DGND_USB) U5.41(GND)
VDD: L10.2 R23.2 R32.2
CK_2540: U5.14(P0_5) ; port SPI1_CK
D_N: C31.1 R26.2 U5.3(USB_N)
D_P: C27.1 R23.1 R24.2 U5.2(USB_P)
DC_2540: U5.34(P2_2) ; port DEB_CLK
DD_2540: U5.35(P2_1) ; port DEB_Dat
DN: R26.1 ; port DN
DP: R24.1 ; port DP
IRQ_C1110: U5.19(P0_0) ; port IO_3
IRQ_C2510: U5.18(P0_1) ; port IO_4
KILL_n: U5.12(P0_7) ; port ADC2
MISO_2540: U5.17(P0_2) ; port SPI1_MI
MOSI_2540: U5.16(P0_3) ; port SPI1_MO
PBm_n: U5.36(P2_0) ; port IO_5
REQ_KILL: U5.13(P0_6) ; port ADC1
RST_2540: R32.1 U5.20(RESET_N) ; port RST_n
SPI_CK: U5.5(P1_5) ; port SPI2_CK
SPI_MI: U5.37(P1_7) ; port SPI2_MI
SPI_MO: U5.38(P1_6) ; port SPI2_MO
SPI_SS_C1110: U5.8(P1_2) ; port IO_1
SPI_SS_C2510: U5.7(P1_3) ; port IO_2
SS_2540: U5.15(P0_4) ; port SPI1_SS
NetA1_1: A1.1 L12.2
NetC30_2: C30.2 U5.33(P2_3) Y3.1(OSC1)
NetC32_2: C32.2 U5.32(P2_4) Y3.2(OSC2)
NetC34_2: C34.2 C36.2 U5.40(DCOUPL)
NetC41_2: C41.2 C43.1 L11.1
NetC42_2: C42.2 L12.1 L13.2
NetC43_2: C43.2 U5.26(RF_N)
NetC45_1: C45.1 C46.2 L14.1
NetC45_2: C45.2 U5.25(RF_P)
NetC46_1: C46.1 L11.2 L13.1
NetC50_2: C50.2 U5.23(XOSC_Q2) Y4.1(OSC1)
NetC55_2: C55.2 U5.22(XOSC_Q1) Y4.3(OSC2)
NetR28_2: R28.2 U5.30(RBIAS)
NetR35_1: U5.11(P1_0) ; port LED1
NetR36_1: U5.9(P1_1) ; port LED2
NetU5_6: U5.6(P1_4) ; port SPI2_SS

### Layout directives
differential pair: D_N, D_P
rule Undefined; rule Differential Pairs Routing [Pref Gap = 14mil    Min Gap  = 10mil    Max Gap  = 14milPref Width = 12mil    Min Width  = 10mil    Max Width  = 12mil]: (no net found under the mark)

### Notes on the sheet
- (near U5) Radio_Test0
- (near U5) Radio_Test1
- (near U5) Radio_Test2
- (near U5) Radio_Test3
- (near U5) Radio_Test4
- (near U5) Radio_Test5
- P1_2
- P1_3
- P0_0
- P0_1
- P2_0

### Library data of the parts
A1 = Antenna_IIFA_1: Antenna single ended IIFA, 2450 MHz
C27 C31 = Cap: Capacitor; Manufacturer: FARNELL; RS: 624-2238; Order N: 1758959; Published: 8-Jun-2000; LatestRevisionDate: 17-Jul-2002; LatestRevisionNote: Re-released for DXP Platform.; PackageReference: RAD-0.3; Publisher: Altium Limited; PackageDescription: Radial Cap, Thru-Hole; 2 Leads; 0.3 in Pin Spacing; FARNELL: 1758959
C30 C50 = Cap: as C3 on sheet cc1110; Published: 8-Jun-2000; LatestRevisionDate: 17-Jul-2002; LatestRevisionNote: Re-released for DXP Platform.; PackageReference: RAD-0.3; Publisher: Altium Limited; PackageDescription: Radial Cap, Thru-Hole; 2 Leads; 0.3 in Pin Spacing; FARNELL: 2218840
C32 C55 = Cap: as C1 on sheet cc1110; Published: 8-Jun-2000; LatestRevisionDate: 17-Jul-2002; LatestRevisionNote: Re-released for DXP Platform.; PackageReference: RAD-0.3; Publisher: Altium Limited; PackageDescription: Radial Cap, Thru-Hole; 2 Leads; 0.3 in Pin Spacing; FARNELL: 2210762
C33 C35 C36 C38 C51 C54 = Cap: as C11 on sheet cc1110; Published: 8-Jun-2000; LatestRevisionDate: 17-Jul-2002; LatestRevisionNote: Re-released for DXP Platform.; PackageReference: RAD-0.3; Publisher: Altium Limited; PackageDescription: Radial Cap, Thru-Hole; 2 Leads; 0.3 in Pin Spacing; FARNELL: 2309011
C34 = Cap: Capacitor; Manufacturer: FARNELL; RS: 653-0490; Order N: 2320857; Published: 8-Jun-2000; LatestRevisionDate: 17-Jul-2002; LatestRevisionNote: Re-released for DXP Platform.; PackageReference: RAD-0.3; Publisher: Altium Limited; PackageDescription: Radial Cap, Thru-Hole; 2 Leads; 0.3 in Pin Spacing; FARNELL: 2320857
C37 = Cap: as C26 on sheet cc1110; Published: 8-Jun-2000; LatestRevisionDate: 17-Jul-2002; LatestRevisionNote: Re-released for DXP Platform.; PackageReference: RAD-0.3; Publisher: Altium Limited; PackageDescription: Radial Cap, Thru-Hole; 2 Leads; 0.3 in Pin Spacing; FARNELL: 1759416
C39 C48 = Cap: as C6 on sheet cc1110; Published: 8-Jun-2000; LatestRevisionDate: 17-Jul-2002; LatestRevisionNote: Re-released for DXP Platform.; PackageReference: RAD-0.3; Publisher: Altium Limited; PackageDescription: Radial Cap, Thru-Hole; 2 Leads; 0.3 in Pin Spacing; FARNELL: 2426879
C41 C42 C46 = Cap: as C14 on sheet cc1110; Published: 8-Jun-2000; LatestRevisionDate: 17-Jul-2002; LatestRevisionNote: Re-released for DXP Platform.; PackageReference: RAD-0.3; Publisher: Altium Limited; PackageDescription: Radial Cap, Thru-Hole; 2 Leads; 0.3 in Pin Spacing; FARNELL: 1611944
C43 C45 = Cap: Capacitor; Manufacturer: FARNELL; RS: 788-0260; Order N: 1758947; Published: 8-Jun-2000; LatestRevisionDate: 17-Jul-2002; LatestRevisionNote: Re-released for DXP Platform.; PackageReference: RAD-0.3; Publisher: Altium Limited; PackageDescription: Radial Cap, Thru-Hole; 2 Leads; 0.3 in Pin Spacing; FARNELL: 1758947
L10 L13 = Inductor: as L9 on sheet cc1110; Published: 8-Jun-2000; LatestRevisionDate: 29-May-2009; LatestRevisionNote: IPC-7351 Footprint Added.; PackageReference: 0402-A; Publisher: Altium Limited; PackageDescription: Chip Inductor; Code_JEITA: 0402; FARNELL: 1669624
L11 L14 = Inductor: Manufacturer: FARNELL; Code_IEC: 1005; RS: 777-6978; Order N: 2103067; Published: 8-Jun-2000; LatestRevisionDate: 29-May-2009; LatestRevisionNote: IPC-7351 Footprint Added.; PackageReference: 0402-A; Publisher: Altium Limited; PackageDescription: Chip Inductor; Code_JEITA: 0402; FARNELL: 2103067
L12 = Inductor: Manufacturer: FARNELL; Code_IEC: 1005; RS: 777-6987; Order N: 2103077; Published: 8-Jun-2000; LatestRevisionDate: 29-May-2009; LatestRevisionNote: IPC-7351 Footprint Added.; PackageReference: 0402-A; Publisher: Altium Limited; PackageDescription: Chip Inductor; Code_JEITA: 0402; FARNELL: 2103077
R23 = Res3: Resistor; Manufacturer: FARNELL; RS: N.E.; Order N: 2331729; Published: 8-Jun-2000; LatestRevisionDate: 29-May-2009; LatestRevisionNote: IPC-7351 Footprint Added.; PackageReference: J1-0603; Publisher: Altium Limited; PackageDescription: Chip Resistor; FARNELL: 2331729
R24 R26 = Res3: Resistor; Manufacturer: FARNELL; RS: 721-7227; Order N: 2331705; Published: 8-Jun-2000; LatestRevisionDate: 29-May-2009; LatestRevisionNote: IPC-7351 Footprint Added.; PackageReference: J1-0603; Publisher: Altium Limited; PackageDescription: Chip Resistor; FARNELL: 2331705
R28 = Res3: as R20 on sheet cc1110; Published: 8-Jun-2000; LatestRevisionDate: 29-May-2009; LatestRevisionNote: IPC-7351 Footprint Added.; PackageReference: J1-0603; Publisher: Altium Limited; PackageDescription: Chip Resistor; FARNELL: 2331750
R32 = Res3: as R1 on sheet cc1110; Published: 8-Jun-2000; LatestRevisionDate: 29-May-2009; LatestRevisionNote: IPC-7351 Footprint Added.; PackageReference: J1-0603; Publisher: Altium Limited; PackageDescription: Chip Resistor; FARNELL: 2333520
U5 = CC2540: Single chip BLE; Manufacturer: FARNELL; RS: 730-0534; PN: CC2540F256RHAT; Order N: 1862837RL; FARNELL: 1862837RL
Y3 = XTAL: as Y1 on sheet cc1110; FARNELL: 2449398; Order N: SP-C14473
Y4 = XTAL_4: Crystal Oscillator; Manufacturer: Smart Prototyping; SP: SP-C9009; RS: *; FARNELL: 1842072; Value: 32MHz; Order N: SP-C9009

## Sheet Alim.SchDoc
size A4
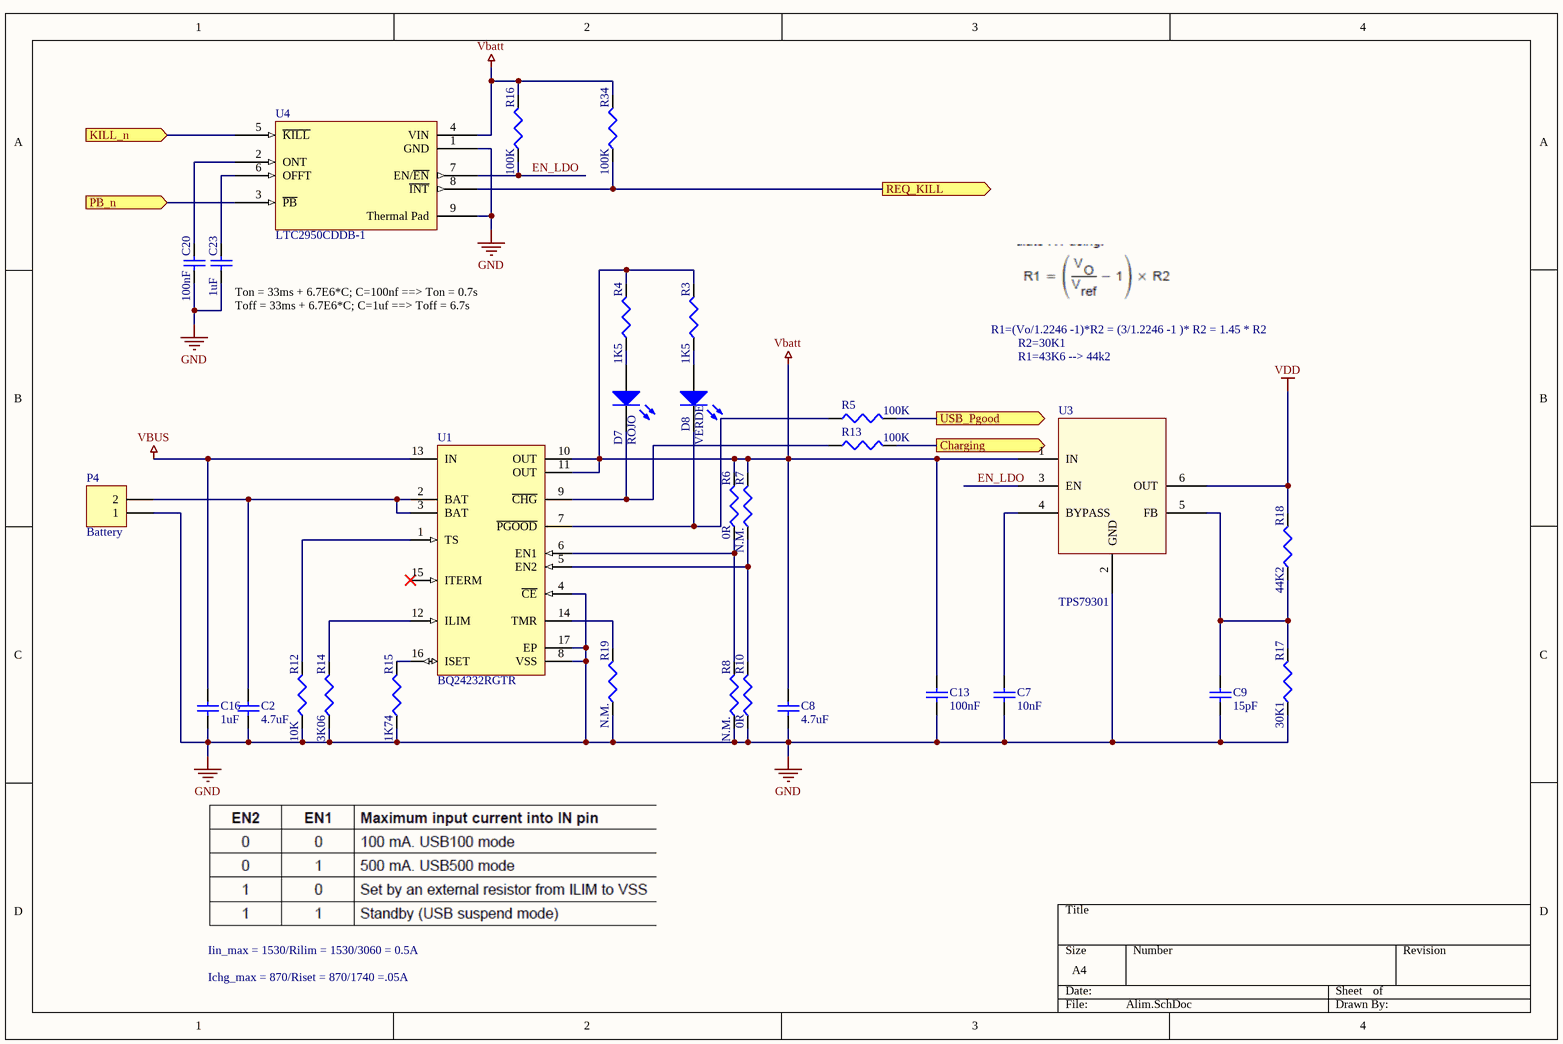
[diagram p4: Alim.SchDoc]

### Parts
C2  value 4.7uF  [C0805]  (hidden comment: Cap)
C7  value 10nF  [0402]  (hidden comment: Cap)
C8  value 4.7uF  [C0805]  (hidden comment: Cap)
C9  value 15pF  [0402]  (hidden comment: Cap)
C13  value 100nF  [0402]  (hidden comment: Cap)
C16  value 1uF  [C0805]  (hidden comment: Cap)
C20  value 100nF  [0402]  (hidden comment: Cap)
C23  value 1uF  [C0805]  (hidden comment: Cap)
D7  ROJO  [led_0805]
D8  VERDE  [led_0805]
P4  Battery  [MOLEX_5268-2]
R3  value 1K5  [J1-0603]  (hidden comment: Res3)
R4  value 1K5  [J1-0603]  (hidden comment: Res3)
R5  value 100K  [J1-0603]  (hidden comment: Res3)
R6  value 0R  [J1-0603]  (hidden comment: Res3)
R7  value N.M.  [J1-0603]  (hidden comment: Res3)
R8  value N.M.  [J1-0603]  (hidden comment: Res3)
R10  value 0R  [J1-0603]  (hidden comment: Res3)
R12  value 10K  [J1-0603]  (hidden comment: Res3)
R13  value 100K  [J1-0603]  (hidden comment: Res3)
R14  value 3K06  [J1-0603]  (hidden comment: Res3)
R15  value 1K74  [J1-0603]  (hidden comment: Res3)
R16  value 100K  [J1-0603]  (hidden comment: Res3)
R17  value 30K1  [J1-0603]  (hidden comment: Res3)
R18  value 44K2  [J1-0603]  (hidden comment: Res3)
R19  value N.M.  [J1-0603]  (hidden comment: Res3)
R34  value 100K  [J1-0603]  (hidden comment: Res3)
U1  BQ24232RGTR  [RGT16-1700X1700TP_SP]
U3  TPS79301  [SOT26A-6M]
U4  LTC2950CDDB-1  [DDB8]

### Ports
Charging (out), KILL_n (in), PB_n (in), REQ_KILL (out), USB_Pgood (out)

### Nets
GND: C2.1 C7.1 C8.1 C9.1 C13.1 C16.1 C20.1 C23.1 P4.1 R8.1 R10.1 R12.1 R14.1 R15.1 R17.1 R19.1 U1.4(~{CE}) U1.8(VSS) U1.17(EP) U3.2(GND) U4.1(GND) U4.9(Thermal_Pad)
Vbatt: C8.2 C13.2 R3.2 R4.2 R6.2 R7.2 R16.2 R34.2 U1.10(OUT) U1.11(OUT) U3.1(IN) U4.4(VIN)
VBUS: C16.2 U1.13(IN)
VDD: R18.2 U3.6(OUT)
Charging: R13.2 ; port Charging
EN_LDO: R16.1 U3.3(EN) U4.7(EN/~{EN})
KILL_n: U4.5(~{KILL}) ; port KILL_n
PB_n: U4.3(~{PB}) ; port PB_n
REQ_KILL: R34.1 U4.8(~{INT}) ; port REQ_KILL
USB_Pgood: R5.2 ; port USB_Pgood
NetC2_2: C2.2 P4.2 U1.2(BAT) U1.3(BAT)
NetC7_2: C7.2 U3.4(BYPASS)
NetC9_2: C9.2 R17.2 R18.1 U3.5(FB)
NetC20_2: C20.2 U4.2(ONT)
NetC23_2: C23.2 U4.6(OFFT)
NetD7_1: D7.1(A) R4.1
NetD7_2: D7.2(K) R13.1 U1.9(~{CHG})
NetD8_1: D8.1(A) R3.1
NetD8_2: D8.2(K) R5.1 U1.7(~{PGOOD})
NetR6_1: R6.1 R8.2 U1.6(EN1)
NetR7_1: R7.1 R10.2 U1.5(EN2)
NetR12_2: R12.2 U1.1(TS)
NetR14_2: R14.2 U1.12(ILIM)
NetR15_2: R15.2 U1.16(ISET)
NetR19_2: R19.2 U1.14(TMR)

Not connected (* = marked no-connect by the designer): U1 15(ITERM)*

### Notes on the sheet
- (near C23) Ton = 33ms + 6.7E6*C; C=100nf ==> Ton = 0.7s
  Toff = 33ms + 6.7E6*C; C=1uf ==> Toff = 6.7s
- R1=(Vo/1.2246 -1)*R2 = (3/1.2246 -1 )* R2 = 1.45 * R2
- R2=30K1
- R1=43K6 --> 44k2
- Iin_max = 1530/Rilim = 1530/3060 = 0.5A
- Ichg_max = 870/Riset = 870/1740 =.05A

### Library data of the parts
C2 C8 = Cap: Capacitor; Manufacturer: FARNELL; RS: 698-3579; Order N: 1759414; Published: 8-Jun-2000; LatestRevisionDate: 17-Jul-2002; LatestRevisionNote: Re-released for DXP Platform.; PackageReference: RAD-0.3; Publisher: Altium Limited; PackageDescription: Radial Cap, Thru-Hole; 2 Leads; 0.3 in Pin Spacing; FARNELL: 1759414
C7 = Cap: Capacitor; Manufacturer: FARNELL; RS: 624-2301; Order N: 1650807; Published: 8-Jun-2000; LatestRevisionDate: 17-Jul-2002; LatestRevisionNote: Re-released for DXP Platform.; PackageReference: RAD-0.3; Publisher: Altium Limited; PackageDescription: Radial Cap, Thru-Hole; 2 Leads; 0.3 in Pin Spacing; FARNELL: 1650807
C9 = Cap: as C3 on sheet cc1110; Published: 8-Jun-2000; LatestRevisionDate: 17-Jul-2002; LatestRevisionNote: Re-released for DXP Platform.; PackageReference: RAD-0.3; Publisher: Altium Limited; PackageDescription: Radial Cap, Thru-Hole; 2 Leads; 0.3 in Pin Spacing; FARNELL: 2218840
C13 C20 = Cap: as C11 on sheet cc1110; Published: 8-Jun-2000; LatestRevisionDate: 17-Jul-2002; LatestRevisionNote: Re-released for DXP Platform.; PackageReference: RAD-0.3; Publisher: Altium Limited; PackageDescription: Radial Cap, Thru-Hole; 2 Leads; 0.3 in Pin Spacing; FARNELL: 2309011
C16 C23 = Cap: as C34 on sheet CC2540; Published: 8-Jun-2000; LatestRevisionDate: 17-Jul-2002; LatestRevisionNote: Re-released for DXP Platform.; PackageReference: RAD-0.3; Publisher: Altium Limited; PackageDescription: Radial Cap, Thru-Hole; 2 Leads; 0.3 in Pin Spacing; FARNELL: 2320857
D7 = LED2: as D1 on sheet TOP; FARNELL: 2099236; Value: Rojo; Order N: SP-C2286
D8 = LED2: as D2 on sheet TOP; FARNELL: 2290331; Value: Verde; Order N: SP-C2292
P4 = Header 2: Header, 2-Pin; Manufacturer: FARNELL; Order N: 9979611; LatestRevisionDate: 17-Jul-2002; LatestRevisionNote: Re-released for DXP Platform.; Publisher: Altium Limited; FARNELL: 9979611
R3 R4 = Res3: as R23 on sheet CC2540; Published: 8-Jun-2000; LatestRevisionDate: 29-May-2009; LatestRevisionNote: IPC-7351 Footprint Added.; PackageReference: J1-0603; Publisher: Altium Limited; PackageDescription: Chip Resistor; FARNELL: 2331729
R5 R13 R16 R34 = Res3: Resistor; Manufacturer: FARNELL; RS: N.E.; Order N: 2331753; Published: 8-Jun-2000; LatestRevisionDate: 29-May-2009; LatestRevisionNote: IPC-7351 Footprint Added.; PackageReference: J1-0603; Publisher: Altium Limited; PackageDescription: Chip Resistor; FARNELL: 2331753
R6 R10 = Res3: Resistor; Manufacturer: FARNELL; RS: 740-8870; Order N: 2309106; Published: 8-Jun-2000; LatestRevisionDate: 29-May-2009; LatestRevisionNote: IPC-7351 Footprint Added.; PackageReference: J1-0603; Publisher: Altium Limited; PackageDescription: Chip Resistor; FARNELL: 2309106
R7 R8 R19 = Res3: Resistor; Published: 8-Jun-2000; LatestRevisionDate: 29-May-2009; LatestRevisionNote: IPC-7351 Footprint Added.; PackageReference: J1-0603; Publisher: Altium Limited; PackageDescription: Chip Resistor
R12 = Res3: as R1 on sheet cc1110; Published: 8-Jun-2000; LatestRevisionDate: 29-May-2009; LatestRevisionNote: IPC-7351 Footprint Added.; PackageReference: J1-0603; Publisher: Altium Limited; PackageDescription: Chip Resistor; FARNELL: 2333520
R14 = Res3: Resistor; Manufacturer: FARNELL; RS: N.E.; Order N: 1527525; Published: 8-Jun-2000; LatestRevisionDate: 29-May-2009; LatestRevisionNote: IPC-7351 Footprint Added.; PackageReference: J1-0603; Publisher: Altium Limited; PackageDescription: Chip Resistor; FARNELL: 1527525
R15 = Res3: Resistor; Manufacturer: FARNELL; RS: N.E.; Order N: 2116703; Published: 8-Jun-2000; LatestRevisionDate: 29-May-2009; LatestRevisionNote: IPC-7351 Footprint Added.; PackageReference: J1-0603; Publisher: Altium Limited; PackageDescription: Chip Resistor; FARNELL: 2116703
R17 = Res3: Resistor; Manufacturer: FARNELL; RS: N.E.; Order N: 1527635; Published: 8-Jun-2000; LatestRevisionDate: 29-May-2009; LatestRevisionNote: IPC-7351 Footprint Added.; PackageReference: J1-0603; Publisher: Altium Limited; PackageDescription: Chip Resistor; FARNELL: 1527635
R18 = Res3: Resistor; Manufacturer: FARNELL; RS: N.E.; Order N: 1785891; Published: 8-Jun-2000; LatestRevisionDate: 29-May-2009; LatestRevisionNote: IPC-7351 Footprint Added.; PackageReference: J1-0603; Publisher: Altium Limited; PackageDescription: Chip Resistor; FARNELL: 1785891
U1 = BQ24232RGTR: USB Friendly 0.5 A Li+ Charger with Dynamic Power Management, 10.5 V OVP, 4.3 V, -40 to 85 degC, 16-pin QFN (RGT), Green (RoHS & no Sb/Br); Manufacturer: FARNELL; RS: N.E.; PN: BQ24232RGTT; Order N: 2383064; PackageReference: RGT16-1700X1700TP; PackageDescription: 16-Pin Plastic Quad Flat No-Lead, 3 x 3 mm Body, 0.5 mm Pitch, 1.7 x 1.7 mm Exposed Pad; FARNELL: 2383064
U3 = TPS79301: Manufacturer: FARNELL; RS: 661-4478; PN: TPS79301DBVR; Order N: 1460960; FARNELL: 1460960
U4 = LTC2950CDDB-1: Push Button On/Off Controller; Manufacturer: FARNELL; Note: 1915; Order N: 1673537; Published: 30-May-2008; DatasheetVersion: Feb-2008; PackageVersion: Rev B, Sep-2005; PackageReference: DDB8; Publisher: Altium Limited; PackageDescription: 8-Pin Plastic DFN, 3 x 2 x 0.8 mm Body, 0.5 mm Pitch, No Pullback, Exposed Pad (DDB8); Code_JEDEC: MO-229-WECD-1; ComponentLink1Description: Manufacturer Link; ComponentLink1URL: http://www.linear.com/; ComponentLink2Description: Datasheet; ComponentLink2URL: http://www.linear.com/pc/downloadDocument.do?navId=H0,C1,C1003,C1144,C1783,P10330,D7377; FARNELL: 1673537; PN: LTC2950CDDB-1

## Nets that join several sheets
GND: TOP (13 pins), cc1110 (20 pins), cc2510 (20 pins), CC2540 (23 pins), Alim (22 pins)
Vbatt: TOP (R21.2), Alim (12 pins)
VBUS: TOP (J1.1), Alim (C16.2 U1.13)
VDD: TOP (6 pins), cc1110 (L9.2 R1.2), cc2510 (L15.2 R30.2), CC2540 (L10.2 R23.2 R32.2), Alim (R18.2 U3.6)
Charging: cc1110 (U2.6), cc2510 (U6.6), Alim (R13.2)
CK_1110: TOP (P1.6), cc1110 (U2.11)
CK_2510: TOP (P3.6), cc2510 (U6.11)
CK_2540: TOP (P2.6), CC2540 (U5.14)
DC_1110: TOP (P1.3), cc1110 (U2.16)
DC_2510: TOP (P3.3), cc2510 (U6.16)
DC_2540: TOP (P2.3), CC2540 (U5.34)
DD_1110: TOP (P1.4), cc1110 (U2.15)
DD_2510: TOP (P3.4), cc2510 (U6.15)
DD_2540: TOP (P2.4), CC2540 (U5.35)
DN: TOP (J1.2), CC2540 (R26.1)
DP: TOP (J1.3), CC2540 (R24.1)
IRQ_C1110: cc1110 (U2.1), CC2540 (U5.19)
IRQ_C2510: cc2510 (U6.1), CC2540 (U5.18)
KILL_n: TOP (R33.1), CC2540 (U5.12), Alim (U4.5)
MISO_1110: TOP (P1.10), cc1110 (U2.7)
MISO_2510: TOP (P3.10), cc2510 (U6.7)
MISO_2540: TOP (P2.10), CC2540 (U5.17)
MOSI_1110: TOP (P1.8), cc1110 (U2.8)
MOSI_2510: TOP (P3.8), cc2510 (U6.8)
MOSI_2540: TOP (P2.8), CC2540 (U5.16)
NetR2_1: TOP (R2.1), cc1110 (U2.3)
NetR9_1: TOP (R9.1), cc1110 (U2.4)
NetR25_1: TOP (R25.1), cc2510 (U6.3)
NetR27_1: TOP (R27.1), cc2510 (U6.4)
NetR35_1: TOP (R35.1), CC2540 (U5.11)
NetR36_1: TOP (R36.1), CC2540 (U5.9)
PB_n: TOP (R?.1 S1.2), Alim (U4.3)
PBm_n: TOP (R?.2), cc1110 (U2.14), cc2510 (U6.14), CC2540 (U5.36)
REQ_KILL: TOP (R33.2), CC2540 (U5.13), Alim (R34.1 U4.8)
RST_1110: TOP (P1.7), cc1110 (R1.1 U2.31)
RST_2510: TOP (P3.7), cc2510 (R30.1 U6.31)
RST_2540: TOP (P2.7), CC2540 (R32.1 U5.20)
sense_Vbatt: TOP (R21.1 R22.2), cc1110 (U2.12), cc2510 (U6.12)
SPI_CK: cc1110 (U2.34), cc2510 (U6.34), CC2540 (U5.5)
SPI_MI: cc1110 (U2.32), cc2510 (U6.32), CC2540 (U5.37)
SPI_MO: cc1110 (U2.33), cc2510 (U6.33), CC2540 (U5.38)
SPI_SS_C1110: cc1110 (U2.35), CC2540 (U5.8)
SPI_SS_C2510: cc2510 (U6.35), CC2540 (U5.7)
SS_1110: TOP (P1.5), cc1110 (U2.9)
SS_2510: TOP (P3.5), cc2510 (U6.9)
SS_2540: TOP (P2.5), CC2540 (U5.15)
USB_Pgood: cc1110 (U2.5), cc2510 (U6.5), Alim (R5.2)